# EAGLE design LED PIPE PROJECT (EAGLE 9.3.0)
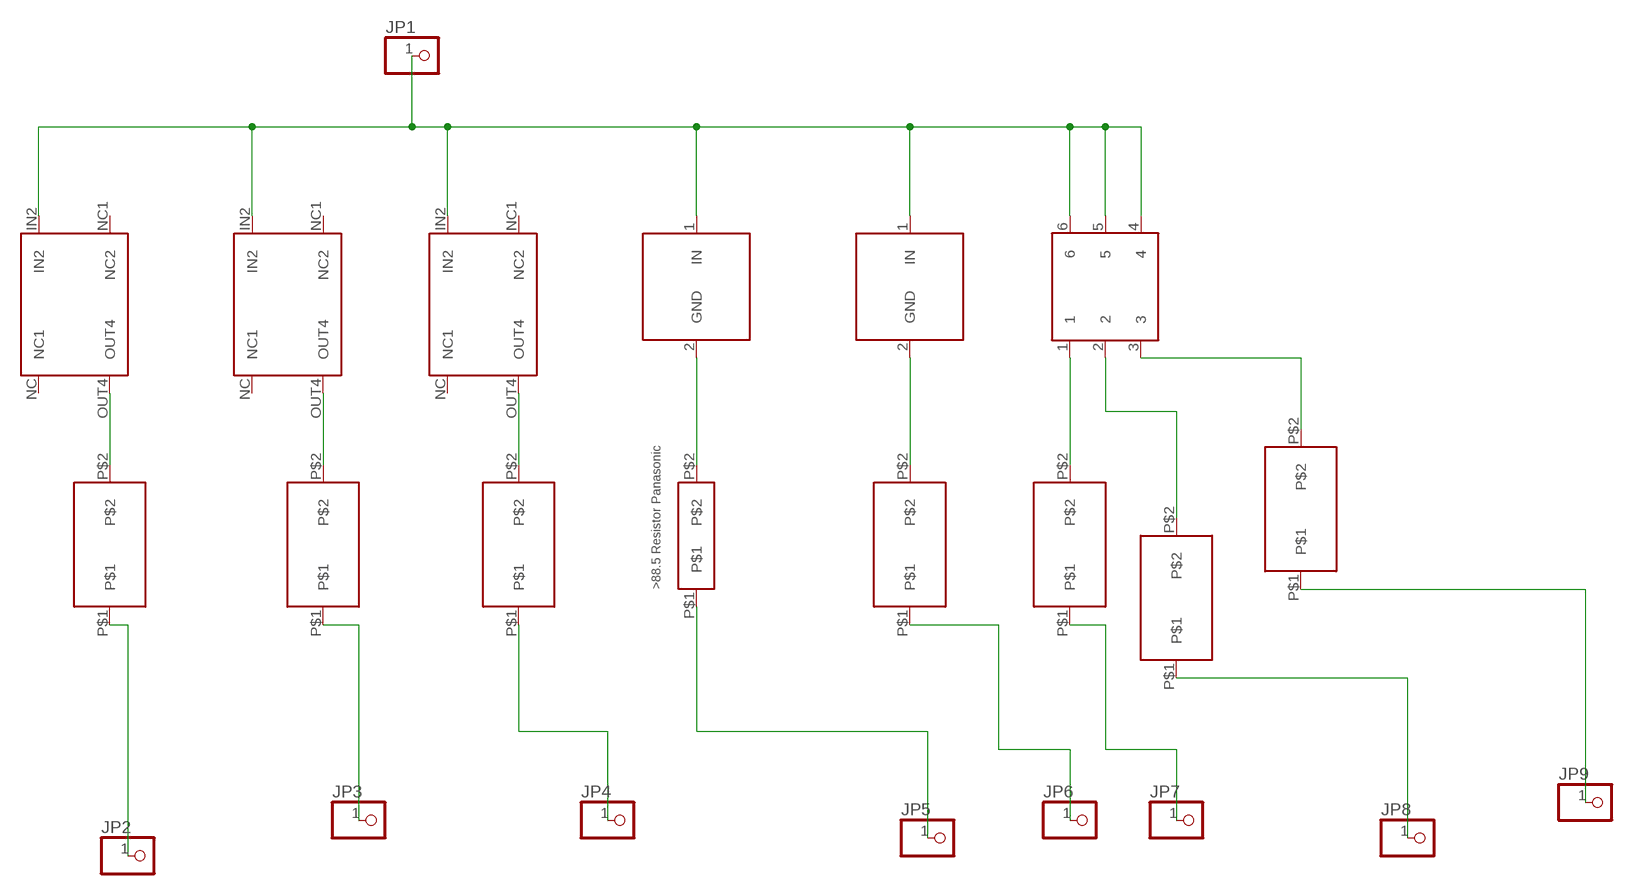
[diagram p0: schematic, sheet 1]

## Parts
JP1  PINHD-1X1  [1X01]
JP2  PINHD-1X1  [1X01]
JP3  PINHD-1X1  [1X01]
JP4  PINHD-1X1  [1X01]
JP5  PINHD-1X1  [1X01]
JP6  PINHD-1X1  [1X01]
JP7  PINHD-1X1  [1X01]
JP8  PINHD-1X1  [1X01]
JP9  PINHD-1X1  [1X01]
U$1  UV_LED  [UV_LED]
U$2  IR_LED  [IR_LED]
U$3  SMALL_RGB  [SMALL_RGB]
U$4  SMALL_BRIGHT_COOL_WHITE  [SMALL_BRIGHT_COOL_WHITE]
U$5  SMALL_BRIGHT_COOL_WHITE  [SMALL_BRIGHT_COOL_WHITE]
U$6  SMALL_BRIGHT_COOL_WHITE  [SMALL_BRIGHT_COOL_WHITE]
U$7  68_60_56_RESISTOR_VISHAY  [68_60_56_RESISTOR_VISHAY]
U$8  68_60_56_RESISTOR_VISHAY  [68_60_56_RESISTOR_VISHAY]
U$9  68_60_56_RESISTOR_VISHAY  [68_60_56_RESISTOR_VISHAY]
U$10  88.5_RESISTOR_PANASONIC  [88.7_RESISTOR_PANASONIC]
U$11  68_60_56_RESISTOR_VISHAY  [68_60_56_RESISTOR_VISHAY]
U$12  68_60_56_RESISTOR_VISHAY  [68_60_56_RESISTOR_VISHAY]
U$13  68_60_56_RESISTOR_VISHAY  [68_60_56_RESISTOR_VISHAY]
U$14  68_60_56_RESISTOR_VISHAY  [68_60_56_RESISTOR_VISHAY]

## Nets
N$1: JP1.1 U$1.1(IN) U$2.1(IN) U$3.4 U$3.5 U$3.6 U$4.IN2 U$5.IN2 U$6.IN2
N$2: U$6.OUT4 U$7.P$2
N$3: U$5.OUT4 U$8.P$2
N$4: U$4.OUT4 U$9.P$2
N$5: U$1.2(GND) U$10.P$2
N$6: U$2.2(GND) U$11.P$2
N$7: U$3.1 U$12.P$2
N$8: U$3.2 U$13.P$2
N$9: U$3.3 U$14.P$2
N$10: JP2.1 U$7.P$1
N$11: JP3.1 U$8.P$1
N$12: JP4.1 U$9.P$1
N$13: JP5.1 U$10.P$1
N$14: JP6.1 U$11.P$1
N$15: JP7.1 U$12.P$1
N$16: JP8.1 U$13.P$1
N$17: JP9.1 U$14.P$1
Unconnected: U$4.NC1(NC2) U$4.NC(NC1) U$5.NC1(NC2) U$5.NC(NC1) U$6.NC1(NC2) U$6.NC(NC1)

## Library data of the parts
JP1-JP9 = pinhead:PINHD-1X1: PIN HEADER
U$1 = PCB_LED:UV_LED
U$2 = PCB_LED:IR_LED
U$3 = PCB_LED:SMALL_RGB
U$4-U$6 = PCB_LED:SMALL_BRIGHT_COOL_WHITE
U$7-U$9 U$11-U$14 = PCB_LED:68_60_56_RESISTOR_VISHAY
U$10 = PCB_LED:88.5_RESISTOR_PANASONIC

## Net classes
0 default: width 0.254 mm

## Board
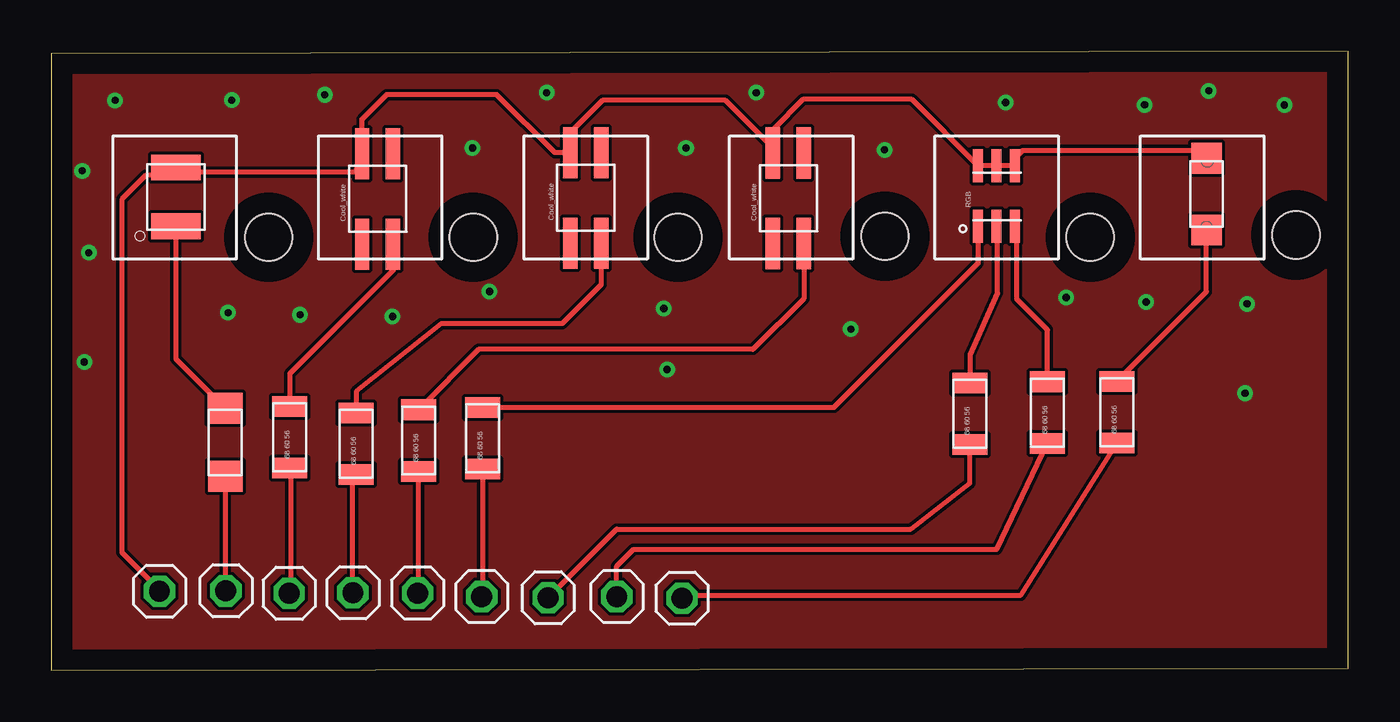
[diagram p1: board, top side]
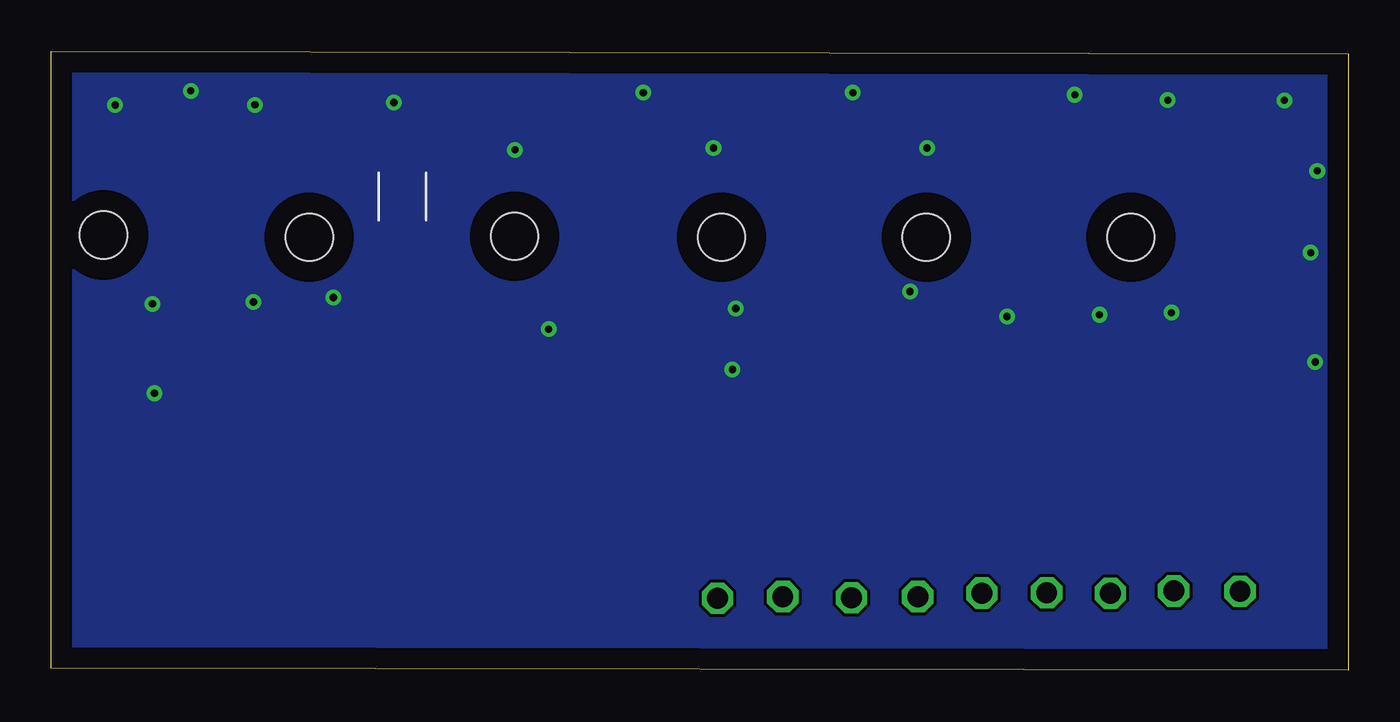
[diagram p2: board, bottom side, seen from below]

Size 63.1 x 30.11 mm. Coordinates in mm from the lower left corner, seen from the top.
Outline: 0,0 63.1,0.11 63.1,30.11 0,30 0,0
Copper layers (1*16): Top 0.035mm / dielectric 1.5mm / Bottom 0.035mm
Design rules "default": minimum track width 6mil, minimum drill 0.35mm, track to track 6mil, track to pad 6mil, pad to pad 6mil, via to via 6mil, smd to smd 6mil, copper to edge 40mil, drill to drill 6mil, minimum pad ring 10mil, minimum via ring 8mil, stop-mask expansion 4mil, vias tented up to drill 0mil, thermal gap 10mil
Holes 2.3 mm at 10.57,21.07 20.53,21.07 30.49,21.07 40.56,21.12 50.55,21.07 60.56,21.18

### Footprints (pad centres in the part's own frame; a part is rotated, then mirrored left to right if it is on the bottom)
1X01 = drill 1.016 octagon: 1 0,0
UV_LED = smd 2.4 x 1.25: 1 0,1.425; 2 0,-1.425
IR_LED = smd 1.5 x 1.5: 1 0,1.75; 2 0,-1.75
SMALL_RGB = smd 0.5 x 1.6: 1 0.9,1.475; 2 0,1.475; 3 -0.9,1.475; 4 -0.9,-1.475; 5 0,-1.475; 6 0.9,-1.475
SMALL_BRIGHT_COOL_WHITE = smd 0.7 x 2.5: IN2 0.75,-2.2; NC 0.75,2.2; NC1 -0.75,-2.2; OUT4 -0.75,2.2
68_60_56_RESISTOR_VISHAY = smd 1 x 1.7: P$1 -3,0; P$2 0,0
88.7_RESISTOR_PANASONIC = smd 1.5 x 1.7: P$1 -2.96,-0.01; P$2 0.35,0

### Placement (x,y rotation side)
JP1  5.26,3.85 0 top
JP2  17.82,3.76 0 top
JP3  14.67,3.78 0 top
JP4  11.57,3.75 0 top
JP5  8.49,3.87 0 top
JP6  30.69,3.51 0 top
JP7  20.94,3.59 0 top
JP8  24.17,3.53 0 top
JP9  27.51,3.59 0 top
U$1  6.06,23.03 0 top
U$2  56.21,23.17 0 top
U$3  45.99,23.08 180 top
U$4  15.87,22.93 180 top
U$5  26,22.98 180 top
U$6  35.86,22.96 180 top
U$7  17.86,12.68 90 top
U$8  14.83,12.53 90 top
U$9  11.6,12.84 90 top
U$10  8.46,12.4 90 top
U$11  51.85,14.06 90 top
U$12  20.99,12.79 90 top
U$13  44.69,13.99 90 top
U$14  48.47,14.04 90 top

### Tracks (layer width: path | path; a pad name or v marks a point on that pad's centre or on a via)
GND  (via drill 0.35)
  other vias: 21.32,18.43 1.82,20.32 3.1,27.73 8.78,27.74 20.49,25.41 30.88,25.41 40.54,25.32 46.43,27.62 53.2,27.51 53.27,17.92 29.96,14.64 58.08,13.48 1.6,15 8.6,17.4 12.1,17.3 16.6,17.21 29.8,17.6 38.9,16.6 58.18,17.83 56.32,28.19 1.5,24.3 13.3,28 24.1,28.1 34.3,28.1 60,27.5 49.38,18.14
  pour Top: 0,30 63.1,30 63.1,0 0,0
  pour Bottom: 0,30.01 63.1,30.01 63.1,0 0,0
N$1
  Top 0.254: 14.8,24.23 6.27,24.23 U$1.1 | 14.8,24.23 15.11,24.54 15.11,24.99 U$4.IN2 | 5.5,24.08 5.5,24.38 U$1.1 | U$2.1 55.8,25.3 47.26,25.3 46.81,24.84 46.81,24.69 U$3.4 46.81,24.54 46.04,24.54 U$3.5 45.89,24.54 45.13,24.54 U$3.6 41.87,27.78 36.58,27.78 35.11,26.31 U$6.IN2 35.22,25.3 32.8,27.73 26.82,27.73 25.32,26.22 25.32,25.3 U$5.IN2 24.5,25.18 21.67,28.01 16.31,28.01 15.12,26.82 U$4.IN2 | 14.8,24.23 U$4.IN2 | 5.5,24.08 4.59,24.08 3.43,22.91 3.43,5.74 5.2,3.96 JP1.1 | 5.5,24.08 U$1.1
N$2
  Top 0.254: U$6.OUT4 36.61,18.08 34.14,15.61 20.79,15.61 U$7.P$2
N$3
  Top 0.254: U$5.OUT4 26.75,18.76 24.86,16.87 18.97,16.87 14.83,13.57 U$8.P$2
N$4
  Top 0.254: U$9.P$2 11.6,14.43 16.63,19.46 U$4.OUT4
N$5
  Top 0.254: U$1.2 6.06,15.15 U$10.P$2
N$6
  Top 0.254: U$2.2 56.21,18.42 U$11.P$2
N$7
  Top 0.254: U$3.1 45.09,19.8 38.09,12.79 U$12.P$2
N$8
  Top 0.254: U$3.2 46.04,21.49 46.04,18.37 44.7,15.37 U$13.P$2
N$9
  Top 0.254: U$14.P$2 48.47,16.57 46.96,18.08 46.96,21.49 U$3.3
N$10
  Top 0.254: U$7.P$1 17.86,3.82 17.85,3.81 JP2.1
N$11
  Top 0.254: JP3.1 14.67,9.53 U$8.P$1
N$12
  Top 0.254: U$9.P$1 11.63,9.81 11.63,3.84 11.6,3.81 JP4.1
N$13
  Top 0.254: U$10.P$1 8.46,3.9 JP5.1
N$14
  Top 0.254: U$11.P$1 47.17,3.66 30.8,3.66 JP6.1
N$15
  Top 0.254: JP7.1 20.99,3.59 U$12.P$1
N$16
  Top 0.254: U$13.P$1 44.69,9.1 41.82,6.88 27.51,6.88 24.18,3.55 JP8.1
N$17
  Top 0.254: JP9.1 27.51,5.07 28.33,5.89 46,5.89 U$14.P$1